# Altium schematic sheet Power-Management.SchDoc
size A4; SheetNumber: 7; SheetTotal: 7
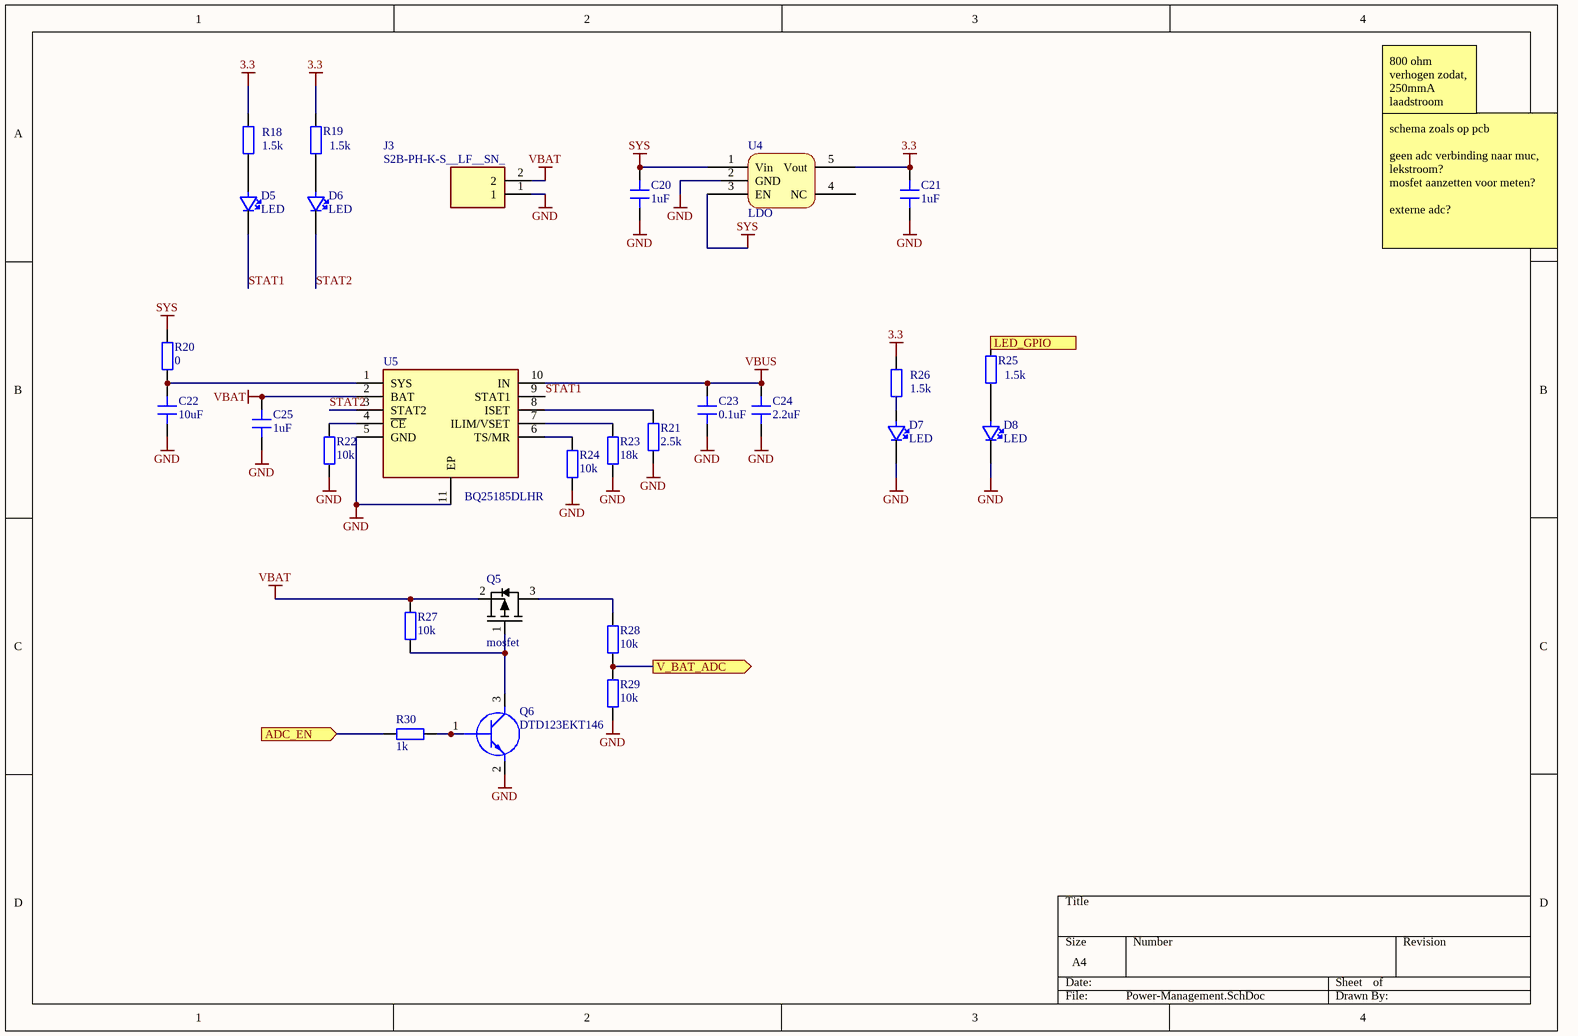
[diagram p0: Power-Management.SchDoc]

## Parts
C20  1uF  [0603_CAP]
C21  1uF  [0603_CAP]
C22  10uF  [0603_CAP]
C23  0.1uF  [0603_CAP]
C24  2.2uF  [0603_CAP]
C25  1uF  [0603_CAP]
D5  LED  [0402_LED]
D6  LED  [0402_LED]
D7  LED  [0402_LED]
D8  LED  [0402_LED]
J3  S2B-PH-K-S__LF__SN_  [S2BPHKSLFSN]
Q5  mosfet  [SOT95P230X110-3N]
Q6  DTD123EKT146  [FP-SS8050-G-IPC_A]
R18  1.5k  [0402_RES]
R19  1.5k  [0402_RES]
R20  0  [0603]
R21  2.5k  [0402_RES]
R22  10k  [0402_RES]
R23  18k  [0402_RES]
R24  10k  [0402_RES]
R25  1.5k  [0402_RES]
R26  1.5k  [0402_RES]
R27  10k  [0402_RES]
R28  10k  [0402_RES]
R29  10k  [0402_RES]
R30  1k  [0402_RES]
U4  LDO  [LDO]
U5  BQ25185DLHR  [SON40P220X200X80-11N]

## Ports
ADC_EN (in, see Smart-Watch-Front[3A]), LED_GPIO (in, see Smart-Watch-Front[3A]), V_BAT_ADC (out, see Smart-Watch-Front[4A])

## Nets
3.3: C21.2 R18.2 R19.2 R26.2 U4.5(Vout)
GND: C20.1 C21.1 C22.1 C23.1 C24.1 C25.1 D7.2(+) D8.2(+) J3.1 Q6.2(E) R21.1 R22.1 R23.1 R24.1 R29.1 U4.2(GND) U5.5(GND) U5.11(EP)
SYS: C20.2 R20.2 U4.1(Vin) U4.3(EN)
VBAT: C25.2 J3.2 Q5.2 R27.2 U5.2(BAT)
VBUS: C23.2 C24.2 U5.10(IN)
ADC_EN: R30.2 ; port ADC_EN
LED_GPIO: R25.2 ; port LED_GPIO
STAT1: D5.2(+) U5.9(STAT1)
STAT2: D6.2(+) U5.3(STAT2)
V_BAT_ADC: R28.1 R29.2 ; port V_BAT_ADC
NetC22_2: C22.2 R20.1 U5.1(SYS)
NetD5_1: D5.1 R18.1
NetD6_1: D6.1 R19.1
NetD7_1: D7.1 R26.1
NetD8_1: D8.1 R25.1
NetQ5_1: Q5.1 Q6.3(C) R27.1
NetQ5_3: Q5.3 R28.2
NetQ6_1: Q6.1(B) R30.1
NetR21_2: R21.2 U5.8(ISET)
NetR22_2: R22.2 U5.4(~{CE})
NetR23_2: R23.2 U5.7(ILIM/VSET)
NetR24_2: R24.2 U5.6(TS/MR)

Not connected (* = marked no-connect by the designer): U4 4(NC)

## Notes on the sheet
- 800 ohm verhogen zodat, 250mmA laadstroom
- schema zoals op pcb
  geen adc verbinding naar muc, lekstroom?
  mosfet aanzetten voor meten?
  externe adc?

## Library data of the parts
C20-C25 = C
J3 = S2B-PH-K-S__LF__SN_: Connector; Manufacturer_Name: JST (JAPAN SOLDERLESS TERMINALS); Manufacturer_Part_Number: S2B-PH-K-S (LF)(SN); Datasheet Link: http://www.jst-mfg.com/product/pdf/eng/ePH.pdf; Height: 4.8mm
Q6 = DTD123EKT146: Transistor BJT NPN; Manufacturer_Name: ROHM Semiconductor; Datasheet Link: http://rohmfs.rohm.com/en/products/databook/datasheet/discrete/transistor/digital/dtd123ekt146-e.pdf; Height: 1.3mm; Manufacturer_Part_Number: DTD123EKT146; Mouser Part Number: 755-DTD123EKT146; Mouser Price/Stock: https://www.mouser.com/Search/Refine.aspx?Keyword=755-DTD123EKT146
R18-R23 R25-R30 = R
R24 = R: NTC thermistor
U5 = BQ25185DLHR: Integrated Circuit; Manufacturer_Name: Texas Instruments; Datasheet Link: https://www.ti.com/lit/ds/symlink/bq25185.pdf?ts=1706857561339&ref_url=https%253A%252F%252Fwww.ti.com%252Fproduct%252FBQ25185; Height: 0.8mm; Manufacturer_Part_Number: BQ25185DLHR; Mouser Part Number: 595-BQ25185DLHR; Mouser Price/Stock: https://www.mouser.co.uk/ProductDetail/Texas-Instruments/BQ25185DLHR?qs=Z%252BL2brAPG1IbO%2FV3RqsaPw%3D%3D